# Altium project AEX1_PiOBD.PrjPcb (part 3 of 3)

## Sheet OBD_STN2120.SchDoc
size A3; DocumentNumber: 3; SheetNumber: 2; SheetTotal: 7; PostalCode_City: PostalCode_City; Country: Country; Company: Robert BOSCH GmbH; TelefonNumber: TelefonNumber; Street: Street; Department: Department
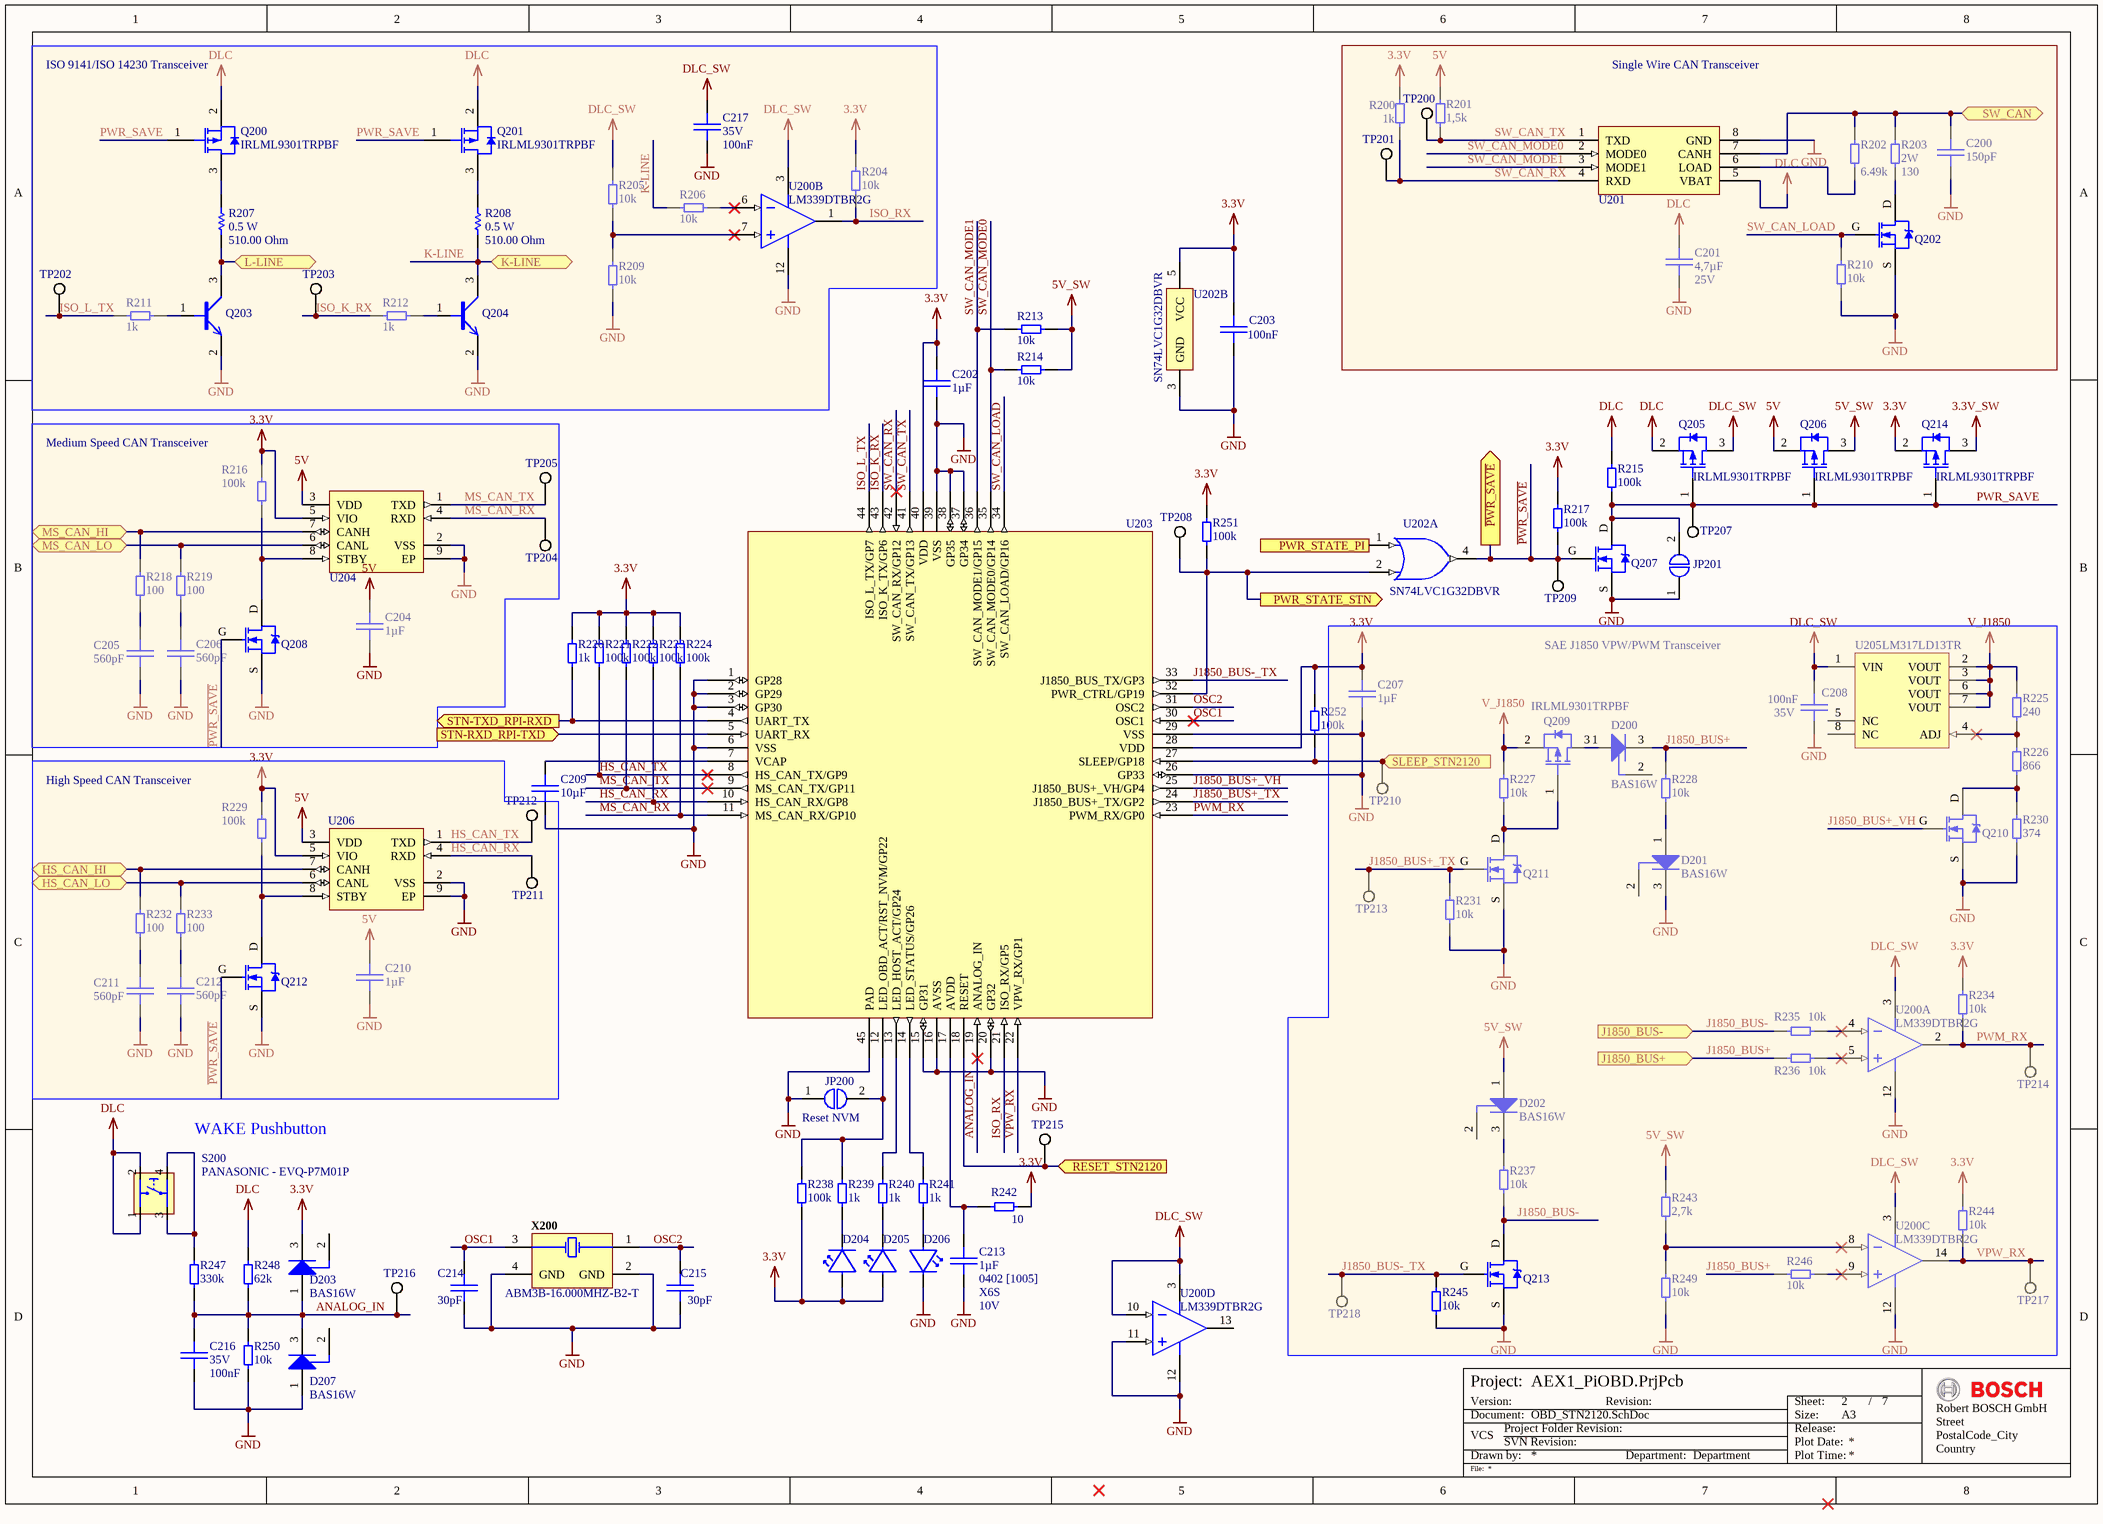
[diagram p6: OBD_STN2120.SchDoc]

### Parts
C200  Capacitance: 150pF  [CAP 0402 [1005 Metric] X050 N]  (hidden comment: CAP 0402 150p -5% +5% 25V C0G)
C201  Capacitance: 4,7µF  Voltage Rating: 25V  [CAP 0603 [1608 Metric] X080 N]  (hidden comment: CAP 0603 4u7 -20% +20% 25V X5R)
C202  Capacitance: 1µF  [CAP 0402 [1005 Metric] X050 N]  (hidden comment: CAP 0402 1u -10% +10% 10V X6S)
C203  Capacitance: 100nF  [CAP 0402 [1005 Metric] X050 N]  (hidden comment: CAP 0402 100n -10% +10% 35V X5R)
C204  Capacitance: 1µF  [CAP 0402 [1005 Metric] X050 N]  (hidden comment: CAP 0402 1u -10% +10% 10V X6S)
C205  Capacitance: 560pF  [CAP 0402 [1005 Metric] X050 N]  (hidden comment: CAP 0402 560p -5% +5% 25V C0G)
C206  Capacitance: 560pF  [CAP 0402 [1005 Metric] X050 N]  (hidden comment: CAP 0402 560p -5% +5% 25V C0G)
C207  Capacitance: 1µF  [CAP 0402 [1005 Metric] X050 N]  (hidden comment: CAP 0402 1u -10% +10% 10V X6S)
C208  Voltage Rating: 35V  Capacitance: 100nF  [CAP 0402 [1005 Metric] X050 N]  (hidden comment: CAP 0402 100n -10% +10% 35V X5R)
C209  Capacitance: 10µF  [CAP 0603 [1608 Metric] X080 N]  (hidden comment: CAP 0603 10µF -10% + 10% 16V X5R)
C210  Capacitance: 1µF  [CAP 0402 [1005 Metric] X050 N]  (hidden comment: CAP 0402 1u -10% +10% 10V X6S)
C211  Capacitance: 560pF  [CAP 0402 [1005 Metric] X050 N]  (hidden comment: CAP 0402 560p -5% +5% 25V C0G)
C212  Capacitance: 560pF  [CAP 0402 [1005 Metric] X050 N]  (hidden comment: CAP 0402 560p -5% +5% 25V C0G)
C213  Capacitance: 1µF  Case: 0402 [1005]  Dielectric Type: X6S  Voltage Rating: 10V  [CAP 0402 [1005 Metric] X050 N]  (hidden comment: CAP 0402 1u -10% +10% 10V X6S)
C214  Capacitance: 30pF  [CAP 0402 [1005 Metric] X050 N]  (hidden comment: CAP 0402 30p -2% +2% 25V C0G)
C215  Capacitance: 30pF  [CAP 0402 [1005 Metric] X050 N]  (hidden comment: CAP 0402 30p -2% +2% 25V C0G)
C216  Voltage Rating: 35V  Capacitance: 100nF  [CAP 0402 [1005 Metric] X050 N]  (hidden comment: CAP 0402 100n -10% +10% 35V X5R)
C217  Voltage Rating: 35V  Capacitance: 100nF  [CAP 0402 [1005 Metric] X050 N]  (hidden comment: CAP 0402 100n -10% +10% 35V X5R)
D200  BAS16W  [INF-SOT323_M]
D201  BAS16W  [INF-SOT323_M]
D202  BAS16W  [INF-SOT323_M]
D203  BAS16W  [INF-SOT323_M]
D204  ROHM - SML-P11MT(R)  [ROHM - SML-P11x Series]  (value not drawn)
D205  ROHM - SML-P11MT(R)  [ROHM - SML-P11x Series]  (value not drawn)
D206  ROHM - SML-P11MT(R)  [ROHM - SML-P11x Series]  (value not drawn)
D207  BAS16W  [INF-SOT323_M]
JP200  Solder Jumper 0402 unbestückt  [Solder Jumper 0402 unbestückt]  (value not drawn)
JP201  Solder Jumper 0402 unbestückt  [Solder Jumper 0402 unbestückt]  (value not drawn)
Q200  IRLML9301TRPBF  [INF-SOT-23-3_V]
Q201  IRLML9301TRPBF  [INF-SOT-23-3_V]
Q202  ON SEMICONDUCTOR - BSS138  [SOT23127P600-8N]  (value not drawn)
Q203  DIODES INCORPORATED - MMBT2222A-7-F  [SOT23]  (value not drawn)
Q204  DIODES INCORPORATED - MMBT2222A-7-F  [SOT23]  (value not drawn)
Q205  IRLML9301TRPBF  [INF-SOT-23-3_V]
Q206  IRLML9301TRPBF  [INF-SOT-23-3_V]
Q207  ON SEMICONDUCTOR - BSS138  [SOT23127P600-8N]  (value not drawn)
Q208  ON SEMICONDUCTOR - BSS138  [SOT23127P600-8N]  (value not drawn)
Q209  IRLML9301TRPBF  [INF-SOT-23-3_V]
Q210  ON SEMICONDUCTOR - BSS138  [SOT23127P600-8N]  (value not drawn)
Q211  ON SEMICONDUCTOR - BSS138  [SOT23127P600-8N]  (value not drawn)
Q212  ON SEMICONDUCTOR - BSS138  [SOT23127P600-8N]  (value not drawn)
Q213  ON SEMICONDUCTOR - BSS138  [SOT23127P600-8N]  (value not drawn)
Q214  IRLML9301TRPBF  [INF-SOT-23-3_V]
R200  Resistance: 1k  [RES 0402 [1005 Metric]_N]  (hidden comment: RES 0402 1K 1% 62.5mW)
R201  Resistance: 1,5k  [RES 0402 [1005 Metric]_N]  (hidden comment: RES 0402 1K5 1% 62.5mW)
R202  Resistance: 6.49k  [RES 0805 [2012 Metric] X070 N]  (hidden comment: RES 0805 6K49 1% 125mW)
R203  Power Rating: 2W  Resistance: 130  [RES 2512 [6432 Metric] M]  (hidden comment: RES 2512 130R 1% 2W)
R204  Resistance: 10k  [RES 0402 [1005 Metric]_N]  (hidden comment: RES 0402 10K 1% 62.5mW)
R205  Resistance: 10k  [RES 0402 [1005 Metric]_N]  (hidden comment: RES 0402 10K 1% 62.5mW)
R206  Resistance: 10k  [RES 0402 [1005 Metric]_N]  (hidden comment: RES 0402 10K 1% 62.5mW)
R207  value 510.00 Ohm  Power: 0.5 W  [RESC1210(3225)_L]  (hidden comment: 510R 5% 1210(3225))
R208  value 510.00 Ohm  Power: 0.5 W  [RESC1210(3225)_L]  (hidden comment: 510R 5% 1210(3225))
R209  Resistance: 10k  [RES 0402 [1005 Metric]_N]  (hidden comment: RES 0402 10K 1% 62.5mW)
R210  Resistance: 10k  [RES 0402 [1005 Metric]_N]  (hidden comment: RES 0402 10K 1% 62.5mW)
R211  Resistance: 1k  [RES 0402 [1005 Metric]_N]  (hidden comment: RES 0402 1K 1% 62.5mW)
R212  Resistance: 1k  [RES 0402 [1005 Metric]_N]  (hidden comment: RES 0402 1K 1% 62.5mW)
R213  Resistance: 10k  [RES 0402 [1005 Metric]_N]  (hidden comment: RES 0402 10K 1% 62.5mW)
R214  Resistance: 10k  [RES 0402 [1005 Metric]_N]  (hidden comment: RES 0402 10K 1% 62.5mW)
R215  Resistance: 100k  [RES 0402 [1005 Metric]_N]  (hidden comment: RES 0402 100K 1% 62.5mW)
R216  Resistance: 100k  [RES 0402 [1005 Metric]_N]  (hidden comment: RES 0402 100K 1% 62.5mW)
R217  Resistance: 100k  [RES 0402 [1005 Metric]_N]  (hidden comment: RES 0402 100K 1% 62.5mW)
R218  Resistance: 100  [RES 0402 [1005 Metric]_N]  (hidden comment: RES 0402 100R 1% 62.5mW)
R219  Resistance: 100  [RES 0402 [1005 Metric]_N]  (hidden comment: RES 0402 100R 1% 62.5mW)
R220  Resistance: 1k  [RES 0402 [1005 Metric]_N]  (hidden comment: RES 0402 1K 1% 62.5mW)
R221  Resistance: 100k  [RES 0402 [1005 Metric]_N]  (hidden comment: RES 0402 100K 1% 62.5mW)
R222  Resistance: 100k  [RES 0402 [1005 Metric]_N]  (hidden comment: RES 0402 100K 1% 62.5mW)
R223  Resistance: 100k  [RES 0402 [1005 Metric]_N]  (hidden comment: RES 0402 100K 1% 62.5mW)
R224  Resistance: 100k  [RES 0402 [1005 Metric]_N]  (hidden comment: RES 0402 100K 1% 62.5mW)
R225  Resistance: 240  [RES 0402 [1005 Metric]_N]  (hidden comment: RES 0402 240R 1% 62.5mW)
R226  Resistance: 866  [RES 0402 [1005 Metric]_N]  (hidden comment: RES 0402 866R 1% 62.5mW)
R227  Resistance: 10k  [RES 0402 [1005 Metric]_N]  (hidden comment: RES 0402 10K 1% 62.5mW)
R228  Resistance: 10k  [RES 0402 [1005 Metric]_N]  (hidden comment: RES 0402 10K 1% 62.5mW)
R229  Resistance: 100k  [RES 0402 [1005 Metric]_N]  (hidden comment: RES 0402 100K 1% 62.5mW)
R230  Resistance: 374  [RES 0402 [1005 Metric]_N]  (hidden comment: RES 0402 374R 1% 62.5mW)
R231  Resistance: 10k  [RES 0402 [1005 Metric]_N]  (hidden comment: RES 0402 10K 1% 62.5mW)
R232  Resistance: 100  [RES 0402 [1005 Metric]_N]  (hidden comment: RES 0402 100R 1% 62.5mW)
R233  Resistance: 100  [RES 0402 [1005 Metric]_N]  (hidden comment: RES 0402 100R 1% 62.5mW)
R234  Resistance: 10k  [RES 0402 [1005 Metric]_N]  (hidden comment: RES 0402 10K 1% 62.5mW)
R235  Resistance: 10k  [RES 0402 [1005 Metric]_N]  (hidden comment: RES 0402 10K 1% 62.5mW)
R236  Resistance: 10k  [RES 0402 [1005 Metric]_N]  (hidden comment: RES 0402 10K 1% 62.5mW)
R237  Resistance: 10k  [RES 0402 [1005 Metric]_N]  (hidden comment: RES 0402 10K 1% 62.5mW)
R238  Resistance: 100k  [RES 0402 [1005 Metric]_N]  (hidden comment: RES 0402 100K 1% 62.5mW)
R239  Resistance: 1k  [RES 0402 [1005 Metric]_N]  (hidden comment: RES 0402 1K 1% 62.5mW)
R240  Resistance: 1k  [RES 0402 [1005 Metric]_N]  (hidden comment: RES 0402 1K 1% 62.5mW)
R241  Resistance: 1k  [RES 0402 [1005 Metric]_N]  (hidden comment: RES 0402 1K 1% 62.5mW)
R242  Resistance: 10  [RES 0402 [1005 Metric]_N]  (hidden comment: RES 0402 10R 1% 62.5mW)
R243  Resistance: 2,7k  [RES 0402 [1005 Metric]_N]  (hidden comment: RES 0402 2K7 1% 62.5mW)
R244  Resistance: 10k  [RES 0402 [1005 Metric]_N]  (hidden comment: RES 0402 10K 1% 62.5mW)
R245  Resistance: 10k  [RES 0402 [1005 Metric]_N]  (hidden comment: RES 0402 10K 1% 62.5mW)
R246  Resistance: 10k  [RES 0402 [1005 Metric]_N]  (hidden comment: RES 0402 10K 1% 62.5mW)
R247  Resistance: 330k  [RES 0402 [1005 Metric] L]  (hidden comment: RES 0402 330K 1% 62.5mW)
R248  Resistance: 62k  [RES 0402 [1005 Metric]_N]  (hidden comment: RES 0402 62K 1% 62.5mW)
R249  Resistance: 10k  [RES 0402 [1005 Metric]_N]  (hidden comment: RES 0402 10K 1% 62.5mW)
R250  Resistance: 10k  [RES 0402 [1005 Metric]_N]  (hidden comment: RES 0402 10K 1% 62.5mW)
R251  Resistance: 100k  [RES 0402 [1005 Metric]_N]  (hidden comment: RES 0402 100K 1% 62.5mW)
R252  Resistance: 100k  [RES 0402 [1005 Metric]_N]  (hidden comment: RES 0402 100K 1% 62.5mW)
S200  PANASONIC - EVQ-P7M01P  [EVQP7M]
TP200  Testpad, 1.0mm x 1.0mm, round  [Testpad, 1.0mm x 1.0mm, round]  (value not drawn)  (no BOM)
TP201  Testpad, 1.0mm x 1.0mm, round  [Testpad, 1.0mm x 1.0mm, round]  (value not drawn)  (no BOM)
TP202  Testpad, 1.0mm x 1.0mm, round  [Testpad, 1.0mm x 1.0mm, round]  (value not drawn)  (no BOM)
TP203  Testpad, 1.0mm x 1.0mm, round  [Testpad, 1.0mm x 1.0mm, round]  (value not drawn)  (no BOM)
TP204  Testpad, 1.0mm x 1.0mm, round  [Testpad, 1.0mm x 1.0mm, round]  (value not drawn)  (no BOM)
TP205  Testpad, 1.0mm x 1.0mm, round  [Testpad, 1.0mm x 1.0mm, round]  (value not drawn)  (no BOM)
TP207  Testpad, 1.0mm x 1.0mm, round  [Testpad, 1.0mm x 1.0mm, round]  (value not drawn)  (no BOM)
TP208  Testpad, 1.0mm x 1.0mm, round  [Testpad, 1.0mm x 1.0mm, round]  (value not drawn)  (no BOM)
TP209  Testpad, 1.0mm x 1.0mm, round  [Testpad, 1.0mm x 1.0mm, round]  (value not drawn)  (no BOM)
TP210  Testpad, 1.0mm x 1.0mm, round  [Testpad, 1.0mm x 1.0mm, round]  (value not drawn)  (no BOM)
TP211  Testpad, 1.0mm x 1.0mm, round  [Testpad, 1.0mm x 1.0mm, round]  (value not drawn)  (no BOM)
TP212  Testpad, 1.0mm x 1.0mm, round  [Testpad, 1.0mm x 1.0mm, round]  (value not drawn)  (no BOM)
TP213  Testpad, 1.0mm x 1.0mm, round  [Testpad, 1.0mm x 1.0mm, round]  (value not drawn)  (no BOM)
TP214  Testpad, 1.0mm x 1.0mm, round  [Testpad, 1.0mm x 1.0mm, round]  (value not drawn)  (no BOM)
TP215  Testpad, 1.0mm x 1.0mm, round  [Testpad, 1.0mm x 1.0mm, round]  (value not drawn)  (no BOM)
TP216  Testpad, 1.0mm x 1.0mm, round  [Testpad, 1.0mm x 1.0mm, round]  (value not drawn)  (no BOM)
TP217  Testpad, 1.0mm x 1.0mm, round  [Testpad, 1.0mm x 1.0mm, round]  (value not drawn)  (no BOM)
TP218  Testpad, 1.0mm x 1.0mm, round  [Testpad, 1.0mm x 1.0mm, round]  (value not drawn)  (no BOM)
U200  LM339DTBR2G  [ONSC-TSSOP-14-948G-01_V]  (parts A,B,C,D of 4)
U201  MELEXIS - TH8056KDC-AAA-008-RE  [SOIC127P600X172-8N]  (value not drawn)
U202  SN74LVC1G32DBVR  [DBV0005A_L]  (parts A,B of 2)
U203  OBD SOLUTIONS - STN2120  [QFN65P800X800X100_HS-45N]  (value not drawn)
U204  MICROCHIP - MCP2562-E/MF  [SON65P300X100_HS-9N]  (value not drawn)
U205  LM317LD13TR  [SO8_L]
U206  MICROCHIP - MCP2562-E/MF  [SON65P300X100_HS-9N]  (value not drawn)
X200  ABM3B-16.000MHZ-B2-T  [ABRA-ABM3B-4_V]

### Blocks framed on the sheet
ISO 9141/ISO 14230 Transceiver: C217 Q200 Q201 Q203 Q204 R204-R209 R211 R212 TP202 TP203 U200
Single Wire CAN Transceiver: C200 C201 Q202 R200-R203 R210 TP200 TP201 U201
Medium Speed CAN Transceiver: C204-C206 Q208 R216 R218 R219 TP204 TP205 U204
SAE J1850 VPW/PWM Transceiver: C207 C208 D200-D202 Q209-Q211 Q213 R225-R228 R230 R231 R234-R237 R243-R246 R249 TP210 TP213 TP214 TP217 TP218 U200 U205
High Speed CAN Transceiver: C210-C212 Q212 R229 R232 R233 TP211 TP212 U206

### Ports
HS_CAN_HI (bidir), HS_CAN_LO (bidir), J1850_BUS+ (in), J1850_BUS- (in), K-LINE (bidir), L-LINE (bidir), MS_CAN_HI (bidir), MS_CAN_LO (bidir), PWR_STATE_PI (in), PWR_STATE_STN (out), RESET_STN2120 (in), SLEEP_STN2120 (in), STN-RXD_RPI-TXD (in), STN-TXD_RPI-RXD (out), SW_CAN (bidir), ~{PWR_SAVE} (out)

### Nets
3.3V: C202.2 C203.2 C207.2 D203.3(K) D204.A D205.A Q214.2(SOURCE) R200.1 R204.2 R216.2 R217.2 R220.2 R221.2 R222.2 R223.2 R224.2 R229.2 R234.2 R238.2 R242.2 R244.2 R251.2 R252.2 U202.5(VCC) U203.28(VDD) U203.40(VDD) U204.5(VIO) U206.5(VIO)
3.3V_SW: Q214.3(DRAIN)
5V: C204.1 C210.1 Q206.2(SOURCE) R201.2 U204.3(VDD) U206.3(VDD)
5V_SW: D202.1(A) Q206.3(DRAIN) R213.2 R214.2 R243.2
DLC: C201.2 Q200.2(SOURCE) Q201.2(SOURCE) Q205.2(SOURCE) R215.2 R248.2 S200.1 S200.2 U201.5(VBAT)
DLC_SW: C208.2 C217.2 Q205.3(DRAIN) R205.1 U200.3(VCC) U200.10(IN4-) U205.1(VIN)
GND: C200.1 C201.1 C202.1 C203.1 C204.2 C205.1 C206.1 C207.1 C208.1 C209.1 C210.2 C211.1 C212.1 C213.2 C214.2 C215.2 C216.1 C217.1 D201.3(K) D206.C D207.1(A) JP200.1 JP201.1 Q202.S Q203.2(E) Q204.2(E) Q207.S Q208.S Q210.S Q211.S Q212.S Q213.S R209.2 R210.1 R230.1 R231.1 R245.1 R249.1 R250.1 U200.11(IN4+) U200.12(GND) U201.8(GND) U202.3(GND) U203.1(GP28) U203.2(GP29) U203.3(GP30) U203.6(VSS) U203.15(GP31) U203.16(AVSS) U203.20(GP32) U203.26(GP33) U203.29(VSS) U203.37(GP34) U203.38(GP35) U203.39(VSS) U203.45(PAD) U204.2(VSS) U204.9(EP) U206.2(VSS) U206.9(EP) X200.2(GND) X200.4(GND)
V_J1850: Q209.2(SOURCE) R225.2 R227.2 U205.2(VOUT) U205.3(VOUT) U205.6(VOUT) U205.7(VOUT)
~{PWR_SAVE}: Q207.G Q208.G Q212.G R217.1 TP209.1 U202.4(Y) ; port ~{PWR_SAVE}
ANALOG_IN: C216.2 D203.1(A) D207.3(K) R247.1 R248.1 R250.2 TP216.1 U203.19(ANALOG_IN)
HS_CAN_RX: R223.1 TP211.1 U203.10(HS_CAN_RX/GP8) U206.4(RXD)
HS_CAN_TX: R221.1 TP212.1 U203.8(HS_CAN_TX/GP9) U206.1(TXD)
ISO_K_RX: R212.2 TP203.1 U203.43(ISO_K_TX/GP6)
ISO_L_TX: R211.1 TP202.1 U203.44(ISO_L_TX/GP7)
ISO_RX: R204.1 U200.1(OUT2) U203.21(ISO_RX/GP5)
J1850_BUS+: D200.3(K) R228.2 R236.2 R246.2 ; port J1850_BUS+
J1850_BUS+_TX: Q211.G R231.2 TP213.1 U203.24(J1850_BUS+_TX/GP2)
J1850_BUS+_VH: Q210.G U203.25(J1850_BUS+_VH/GP4)
J1850_BUS-: Q213.D R235.2 R237.1 ; port J1850_BUS-
J1850_BUS-_TX: Q213.G R245.2 TP218.1 U203.33(J1850_BUS_TX/GP3)
K-LINE: Q204.3(C) R206.2 R208.1 ; port K-LINE
MS_CAN_RX: R224.1 TP204.1 U203.11(MS_CAN_RX/GP10) U204.4(RXD)
MS_CAN_TX: R222.1 TP205.1 U203.9(MS_CAN_TX/GP11) U204.1(TXD)
OSC1: C214.1 U203.30(OSC1) X200.3(X2)
OSC2: C215.1 U203.31(OSC2) X200.1(X1)
PWM_RX: R234.1 TP214.1 U200.2(OUT1) U203.23(PWM_RX/GP0)
PWR_SAVE: JP201.2 Q200.1(GATE) Q201.1(GATE) Q205.1(GATE) Q206.1(GATE) Q207.D Q214.1(GATE) R215.1 TP207.1
SW_CAN_LOAD: Q202.G R210.2 U203.34(SW_CAN_LOAD/GP16)
SW_CAN_MODE0: R214.1 U201.2(MODE0) U203.35(SW_CAN_MODE0/GP14)
SW_CAN_MODE1: R213.1 U201.3(MODE1) U203.36(SW_CAN_MODE1/GP15)
SW_CAN_RX: R200.2 TP201.1 U201.4(RXD) U203.42(SW_CAN_RX/GP12)
SW_CAN_TX: R201.1 TP200.1 U201.1(TXD) U203.41(SW_CAN_TX/GP13)
VPW_RX: R244.1 TP217.1 U200.14(OUT3) U203.22(VPW_RX/GP1)
NetC200_2: C200.2 R202.2 R203.2 U201.7(CANH) ; port SW_CAN
NetC205_2: C205.2 R218.1
NetC206_2: C206.2 R219.1
NetC209_2: C209.2 U203.7(VCAP)
NetC211_2: C211.2 R232.1
NetC212_2: C212.2 R233.1
NetC213_1: C213.1 R242.1 U203.17(AVDD)
NetD101_1: Q203.3(C) R207.1 ; port L-LINE
NetD103_1: R233.2 U206.6(CANL) ; port HS_CAN_LO
NetD103_2: R232.2 U206.7(CANH) ; port HS_CAN_HI
NetD104_1: R219.2 U204.6(CANL) ; port MS_CAN_LO
NetD104_2: R218.2 U204.7(CANH) ; port MS_CAN_HI
NetD200_1: D200.1(A) Q209.3(DRAIN)
NetD201_1: D201.1(A) R228.1
NetD202_3: D202.3(K) R237.2
NetD204_C: D204.C R239.2
NetD205_C: D205.C R240.2
NetD206_A: D206.A R241.2
NetJ300_2: U203.5(UART_RX) ; port STN-RXD_RPI-TXD
NetJ300_4: R220.1 U203.4(UART_TX) ; port STN-TXD_RPI-RXD
NetJP200_2: JP200.2 R238.1 R239.1 U203.12(LED_OBD_ACT/RST_NVM/GP22)
NetJP301_1: R251.1 TP208.1 U202.2(B) U203.32(PWR_CTRL/GP19) ; port PWR_STATE_STN
NetJP303_1: R252.1 TP210.1 U203.27(SLEEP/GP18) ; port SLEEP_STN2120
NetQ200_3: Q200.3(DRAIN) R207.2
NetQ201_3: Q201.3(DRAIN) R208.2
NetQ202_D: Q202.D R203.1
NetQ203_1: Q203.1(B) R211.2
NetQ204_1: Q204.1(B) R212.1
NetQ208_D: Q208.D R216.1 U204.8(STBY)
NetQ209_1: Q209.1(GATE) Q211.D R227.1
NetQ210_D: Q210.D R226.1 R230.2
NetQ212_D: Q212.D R229.1 U206.8(STBY)
NetQ300_G: U202.1(A) ; port PWR_STATE_PI
NetR202_1: R202.1 U201.6(LOAD)
NetR205_2: R205.2 R209.1 U200.7(IN2+)
NetR206_1: R206.1 U200.6(IN2-)
NetR225_1: R225.1 R226.2 U205.4(ADJ)
NetR235_1: R235.1 U200.4(IN1-)
NetR236_1: R236.1 U200.5(IN1+)
NetR240_1: R240.1 U203.13(LED_HOST_ACT/GP24)
NetR241_1: R241.1 U203.14(LED_STATUS/GP26)
NetR243_1: R243.1 R249.2 U200.8(IN3-)
NetR246_1: R246.1 U200.9(IN3+)
NetR247_2: R247.2 S200.3 S200.4
NetR301_1: TP215.1 U203.18(RESET) ; port RESET_STN2120

Not connected (* = marked no-connect by the designer): D200 2(NC); D201 2(NC); D202 2(NC); D203 2(NC); D207 2(NC); U200 13(OUT4); U205 5(NC) 8(NC)

### Notes on the sheet
- (near JP200) Reset NVM
- (near S200) WAKE Pushbutton
- Project:
- Document:
- Drawn by:
- VCS
- Version:
- Project Folder Revision:
- SVN Revision:
- Revision:
- Department:
- Plot Date:
- Size:
- Sheet:
- Plot Time:
- Release:
- A3
- /
- File:

### Library data of the parts
C200 = CMP-03768-2: SMD/SMT 0402 25V -5% +5% C0G - Multilayer Ceramic Capacitors MLCC; Manufacturer: MURATA; Manufacturer Part Number: GRM1555C1E151JA01#; Assembly: yes; Capacitance Tolerance pos: 5%; Value: 150pF; Capacitance Tolerance neg: -5%; Case: 0402 [1005]; ComponentLink1Description: Datasheet; ComponentLink1URL: http://psearch.en.murata.com/capacitor/lineup/grm/; Dielectric Type: C0G; IPC Footprint Naming: CAPC1005X050; Mounting Type: SMT; Operating Temperature max: 125°C; Operating Temperature min: -55°C; Voltage Rating: 25V
C201 = CMP-05102-1: SMD/SMT 0603 25V -20% +20% X5R - Multilayer Ceramic Capacitors MLCC; Manufacturer: TDK; Manufacturer Part Number: C1608X5R1E475M080AC; Assembly: yes; Capacitance Tolerance pos: 20%; Value: 4,7µF; ItemHRID: CMP-03365; RevisionId: 2; AccessRights: 15; Folder: 10 Library\Component Library\Passive Components\Capacitors\Ceramic Capacitors\; ContentType: Component; Capacitance Tolerance neg: -20%; Case: 0603 [1608]; ComponentLink1Description: Datasheet; ComponentLink1URL: http://www.farnell.com/datasheets/2291921.pdf; Dielectric Type: X5R; IPC Footprint Naming: CAPC1608X080; Mounting Type: SMT; Operating Temperature max: 85°C; Operating Temperature min: -55°C; ReleaseDate: 20/01/2017 12:59:13 PM; ComponentType: Ceramic Capacitor; FolderGUID: 1B932E09-F2A4-48AF-86E9-372599342254; LifeCycle: In Design; AncestorItemRevisionGUID: E51D455D-F8A1-44A6-8671-03D7555E002A; LifeCycleStateGUID: E3052186-9469-4B71-ADAB-0D319103D948; ContentTypeGUID: CB3C11C4-E317-11DF-B822-12313F0024A2; ItemGUID: 2606C917-888A-4062-919A-A6B1386C23AD
C202 C204 C207 C210 C213 = CMP-05092-2: SMD/SMT 0402 10V -10% +10% X6S - Mulitlayer Ceramic Capacitors MLCC; Manufacturer: TDK; Manufacturer Part Number: C1005X6S1A105K050BC; Assembly: yes; Capacitance Tolerance pos: 10%; Value: 1µF; Capacitance Tolerance neg: -10%; ComponentLink1Description: Datasheet; ComponentLink1URL: http://www.farnell.com/datasheets/2291921.pdf; Mounting Type: SMT; Operating Temperature max: 105°C; Operating Temperature min: -55°C
  C202 C204 C207 C210: Case: 0402 [1005]; Dielectric Type: X6S; Voltage Rating: 10V
C203 C208 C216 C217 = CMP-06091-1: SMD/SMT 0402 35V -10% +10% X5R - Multilayer Ceramic Capacitors MLCC; Manufacturer: TDK; Manufacturer Part Number: C1005X5R1V104K050BB; Assembly: yes; Value: 100nF; Capacitance Tolerance pos: 10%; Case: 0402 [1005]; ComponentLink1Description: Datasheet; ComponentLink1URL: https://de.farnell.com/tdk/c1005x5r1v104k050bb/kondensator-0-1-f-35v-10-x5r-0402/dp/2528760?st=100n%200402%2035v; Dielectric Type: X5R; IPC Footprint Naming: CAPC1005X050; Mounting Type: SMT; Operating Temperature max: 85°C; Operating Temperature min: -55°C; Capacitance Tolerance neg: -10%
  C203: Voltage Rating: 35V
C205 C206 C211 C212 = CMP-03930-2: SMD/SMT 0402 25V -5% +5% C0G - Multilayer Ceramic Capacitors MLCC; Manufacturer: MURATA; Manufacturer Part Number: GRM1555C1E561JA01#; Assembly: yes; Capacitance Tolerance pos: 5%; Value: 560pF; Capacitance Tolerance neg: -5%; Case: 0402 [1005]; ComponentLink1Description: Datasheet; Dielectric Type: C0G; ComponentLink1URL: http://psearch.en.murata.com/capacitor/lineup/grm/; IPC Footprint Naming: CAPC1005X050; Mounting Type: SMT; Operating Temperature max: 125°C; Operating Temperature min: -55°C; Voltage Rating: 25V
C209 = CMP-05416-1: Cap Ceramic 10uF 16V X5R 10% Pad SMD 0603 85 T/R; Manufacturer: MURATA; Manufacturer Part Number: GRM188R61C106KAALD; Assembly: yes; Capacitance Tolerance pos: +10%; Capacitance Tolerance neg: -10%; Case: 0603 [1608]; ComponentLink1Description: Datasheet; ComponentLink1URL: https://search.murata.co.jp/Ceramy/image/img/A01X/G101/ENG/GRM188R61C106KAAL-01.pdf; Dielectric Type: X5R; Mounting Type: SMT; Operating Temperature max: 85°C; Operating Temperature min: -55°C; Value: 10µF; Voltage Rating: 16V
C214 C215 = CMP-03847-2: SMD/SMT 0402 25V -2% +2% C0G - Multilayer Ceramic Capacitors MLCC; Manufacturer: MURATA; Manufacturer Part Number: GRM1555C1E300GA01#; Assembly: yes; Capacitance Tolerance pos: 2%; Value: 30pF; Capacitance Tolerance neg: -2%; Case: 0402 [1005]; ComponentLink1URL: http://psearch.en.murata.com/capacitor/lineup/grm/; Dielectric Type: C0G; IPC Footprint Naming: CAPC1005X050; ComponentLink1Description: Datasheet; Mounting Type: SMT; Operating Temperature max: 125°C; Operating Temperature min: -55°C; Voltage Rating: 25V
D200-D203 D207 = CMP-1176-00024-1: Silicon Switching Diode, SOT323, Reel, Green; Manufacturer: Infineon; IR (max): 100Â nA; Configuration: Single; VBR (min): 85Â V; VR (max): 80Â V; trr (max): 4Â ns; Green: TRUE; VF (max): 1.25Â V; IF (max): 250Â mA; Mounting Technology: Surface Mount; PackageReference: SOT323; ComponentLink2URL: http://www.infineon.com/dgdl/bas16series.pdf?folderId=db3a30431400ef6801141b5844e103ea&fileId=db3a30431400ef6801141b93811b03ff; Halogen-free: TRUE; ComponentLink2Description: Datasheet; PartNumber: BAS16W; ComponentLink1Description: Manufacturer URL; ComponentLink3URL: http://www.infineon.com/dgdl/SOT323-Package_Overview.pdf?folderId=db3a30431936bc4b0119533e1dcb3c92&fileId=db3a30431936bc4b011953495f283cb1; ComponentLink1URL: http://www.infineon.com/; PackageDescription: 3-Pin Small Outline Transistor Package, 1.25 x 2 mm Body, 0.65 mm Pitch; ComponentLink3Description: Package Specification
D204-D206 = CMP-06096-1: Standard LEDs - SMD Yellowish Green 569nm 2.1mcd 50mW Pd 1.9V Vf; Assembly: yes; Forward Current LED1: 20mA; Forward Voltage LED1: 1,9V; Reverse Voltage LED1: 5V; Case: 0402; Colour LED1: yellowish green; ComponentLink1Description: Datahseet; ComponentLink1URL: https://d1d2qsbl8m0m72.cloudfront.net/en/products/databook/datasheet/opto/led/chip_mono/sml-p11-e.pdf; Luminous Intensity LED1: 2.1mcd; Manufacturer: ROHM; Manufacturer Part Number: SML-P11MT(R); Mounting Type: SMT; Operating Temperature max: 85°C; Operating Temperature min: -40°C; Wavelength LED1: 569nm
JP200 JP201 = CMP-04662-5: Assembly: no; Case: -; ComponentLink1Description: Datasheet; Manufacturer: -; Manufacturer Part Number: -; Mounting Type: -; Operating Temperature max: 0°C; Operating Temperature min: 0°C
Q200 Q201 Q205 Q206 Q209 Q214 = CMP-2000-06487-1: HEXFET(R) Power MOSFET, 3.6 A, 30 V, -55 to 150 degC, 3-Pin SOT-23, RoHS, Tape and Reel; Manufacturer: InfineonTechnologies; Drain to Source Voltage (Vdss): 30V; Gate Charge (Qg) @ Vgs: 4.8nC@4.5V; Rds On (Max) @ Id, Vgs: 64mOhm@3.6A,10V; FET Type: MOSFETP-Channel,MetalOxide; Current - Continuous Drain (Id) @ 25°C: 3.6A(Ta); Power - Max: 1.3W; Vgs(th) (Max) @ Id: 2.4V@10µA; FET Feature: Standard; Input Capacitance (Ciss) @ Vds: 388pF@25V; Operating Temperature: -55°C~150°C(TJ); Series: HEXFET®; Family: Transistors-FETs,MOSFETs-Single; Manufacturer URL: http://www.infineon.com/; Package Reference: SOT-23-3; Datasheet Version: 02/2012; Category: DiscreteSemiconductorProducts; Part Status: Active; Mounting Technology: SurfaceMount; Datasheet URL: http://www.infineon.com/dgdl/irlml9301pbf.pdf?fileId=5546d462533600a401535668e5e42640; Supplier Device Package: Micro3™/SOT-23; Mounting Type: SurfaceMount; Packaging: Tape&Reel(TR); Package / Case: TO-236-3,SC-59,SOT-23-3; Package Description: 3-Pin Small Outline Transistor, Body 2.92 x 1.3 mm, Pitch 0.95 mm
Q202 Q207 Q208 Q210-Q213 = CMP-00444-5: MOSFET N-CH 50V 220MA SOT-23; Threshold Voltage: 1.3V; Transistor Polarity: N-Channel; Assembly: yes; Drain Source On Resistance: 3.5; Gate Source Voltage: 20V; Operating Temperature min: -55°C; Case: SOT23-3; ComponentLink1Description: Datasheet; ComponentLink1URL: https://www.onsemi.com/pub/Collateral/BSS138-D.PDF; Drain Current DC: 220mA; Drain Source Voltage: 50V; Manufacturer: ON SEMICONDUCTOR; Manufacturer Part Number: BSS138; Mounting Type: SMT; Operating Temperature max: 150°C
Q203 Q204 = CMP-06652-2: NPN small signal transistor, 40V, 600mA, SOT23; Assembly: yes; Collector Basis Voltage: 75V; DC Current Gain max: 300; DC Current Gain min: 100; Emitter Basis Voltage: 6V; Power Dissipation: 300mW; Case: SOT23; Collector Emitter Breakdown Voltage: 40V; Collector Emitter Voltage: 40V; ComponentLink1Description: Manufacturer Link; ComponentLink1URL: http://www.farnell.com/datasheets/2238355.pdf; Manufacturer: DIODES INCORPORATED; Manufacturer Part Number: MMBT2222A-7-F; Mounting Type: SMT; Operating Temperature max: 150°C; Operating Temperature min: -55°C; Transistor Polarity: NPN
R200 R211 R212 R220 R239-R241 = CMP-00843-3: RC0402 series chip resistor with lead-free terminations made by thick film process; Manufacturer Part Number: RC0402FR-071KL; Manufacturer: YAGEO; Power Rating: 62,5mW; Temperature Coefficient: ±100ppm/K; Voltage Rating: 50V; Assembly: yes; Current Rating: 1A; Mounting Type: SMT; Operating Temperature max: 155°C; Operating Temperature min: -55°C; Resistance Tolerance: 1%; Resistor Element Type: Thick Film; Value: 1k; Case: 0402 [1005]; ComponentLink1Description: Datasheet; ComponentLink1URL: http://www.yageo.com/documents/recent/PYu-RC0402_51_RoHS_L_6.pdf; IPC Footprint Naming: RESC1005X04
R201 = CMP-00862-3: RC0402 series chip resistor with lead-free terminations made by thick film process; Manufacturer: YAGEO; Manufacturer Part Number: RC0402FR-071K5L; Current Rating: 1A; Power Rating: 62,5mW; Temperature Coefficient: ±100ppm/K; Value: 1,5k; Voltage Rating: 50V; Assembly: yes; Case: 0402 [1005]; ComponentLink1Description: Datasheet; ComponentLink1URL: http://www.yageo.com/documents/recent/PYu-RC0402_51_RoHS_L_6.pdf; IPC Footprint Naming: RESC1005X04; Mounting Type: SMT; Operating Temperature max: 155°C; Operating Temperature min: -55°C; Resistance Tolerance: 1%; Resistor Element Type: Thick Film
R202 = CMP-02523-5: RC0805 series chip resistor with lead-free terminations made by thick film process; Manufacturer: YAGEO; Manufacturer Part Number: RC0805FR-076K49L; Assembly: yes; Current Rating: 2A; Temperature Coefficient: ±100ppm/K; Value: 6.49k; Voltage Rating: 150V; Case: 0805 [2012]; ComponentLink1Description: Manufacturer Link; ComponentLink1URL: http://www.yageo.com/NewPortal/yageo?service=chipResistors&layer2=Thick%20Film%20General%20Purpose&lang=en; IPC Footprint Naming: RESC2012X07; Mounting Type: SMT; Operating Temperature max: 155°C; Operating Temperature min: -55°C; Power Rating: 125mW; Resistance Tolerance: 1%; Resistor Element Type: Thick Film
R203 = CMP-04950-1: Thick film chip resistor 2512, 2W; Manufacturer: Bourns; Manufacturer Part Number: CRS2512-FW-3R30ELF; Assembly: yes; Temperature Coefficient: 200ppm/K; Value: 130; Voltage Rating: 600V; Case: 2512 [6432]; ComponentLink1Description: Datasheet; ComponentLink1URL: http://www.farnell.com/datasheets/2059763.pdf; IPC Footprint Naming: RESC6432X08; Mounting Type: SMD; Operating Temperature max: 155°C; Operating Temperature min: -55°C; Resistance Tolerance: 1%; Supplier: Farnell; Supplier Part ID: 2470979
R204 R210 R213 R214 = CMP-00958-3: RC0402 series chip resistor with lead-free terminations made by thick film process; Manufacturer: YAGEO; Manufacturer Part Number: RC0402FR-0710KL; Assembly: yes; Current Rating: 1A; Temperature Coefficient: ±100ppm/K; Voltage Rating: 50V; Case: 0402 [1005]; ComponentLink1Description: Datasheet; ComponentLink1URL: http://www.yageo.com/documents/recent/PYu-RC0402_51_RoHS_L_6.pdf; IPC Footprint Naming: RESC1005X04; Mounting Type: SMT; Operating Temperature max: 155°C; Operating Temperature min: -55°C; Power Rating: 62.5mW; Resistance Tolerance: 1%; Resistor Element Type: Thick Film; Value: 10k
R205 R206 R209 R227 R228 R231 R234-R237 R244-R246 R249 R250 = CMP-00958-3: RC0402 series chip resistor with lead-free terminations made by thick film process; Manufacturer: YAGEO; Manufacturer Part Number: RC0402FR-0710KL; Assembly: yes; Current Rating: 1A; Power Rating: 62,5mW; Temperature Coefficient: ±100ppm/K; Voltage Rating: 50V; Case: 0402 [1005]; ComponentLink1Description: Datasheet; ComponentLink1URL: http://www.yageo.com/documents/recent/PYu-RC0402_51_RoHS_L_6.pdf; IPC Footprint Naming: RESC1005X04; Mounting Type: SMT; Operating Temperature max: 155°C; Operating Temperature min: -55°C; Resistance Tolerance: 1%; Resistor Element Type: Thick Film; Value: 10k
R207 R208 = CMP-1015-00067-1: 510R 0.5W 5% 1210 (3225 Metric)  SMD; Case-EIA: 1210; Case-Metric: 3225; Technology: SMT; Tolerance: 5 %
R215-R217 R221-R224 R229 R238 R251 R252 = CMP-01074-3: RC0402 series chip resistor with lead-free terminations made by thick film process; Manufacturer: YAGEO; Manufacturer Part Number: RC0402FR-07100KL; Assembly: yes; Current Rating: 1A; Power Rating: 62,5mW; Temperature Coefficient: ±100ppm/K; Voltage Rating: 50V; Case: 0402 [1005]; ComponentLink1Description: Datasheet; ComponentLink1URL: http://www.yageo.com/documents/recent/PYu-RC0402_51_RoHS_L_6.pdf; IPC Footprint Naming: RESC1005X04; Mounting Type: SMT; Operating Temperature max: 155°C; Operating Temperature min: -55°C; Resistance Tolerance: 1%; Resistor Element Type: Thick Film; Value: 100k
R218 R219 R232 R233 = CMP-00729-3: RC0402 series chip resistor with lead-free terminations made by thick film process; Manufacturer: YAGEO; Manufacturer Part Number: RC0402FR-07100RL; Current Rating: 1A; Power Rating: 62,5mW; Temperature Coefficient: ±100ppm/K; Value: 100; Voltage Rating: 50V; Assembly: yes; Case: 0402 [1005]; ComponentLink1Description: Datasheet; ComponentLink1URL: http://www.yageo.com/documents/recent/PYu-RC0402_51_RoHS_L_6.pdf; IPC Footprint Naming: RESC1005X04; Mounting Type: SMT; Operating Temperature max: 155°C; Operating Temperature min: -55°C; Resistance Tolerance: 1%; Resistor Element Type: Thick Film
R225 = CMP-00770-3: RC0402 series chip resistor with lead-free terminations made by thick film process; Manufacturer: YAGEO; Manufacturer Part Number: RC0402FR-07240RL; Assembly: yes; Current Rating: 1A; Power Rating: 62,5mW; Temperature Coefficient: ±100ppm/K; Value: 240; Voltage Rating: 50V; Case: 0402 [1005]; ComponentLink1Description: Datasheet; ComponentLink1URL: http://www.yageo.com/documents/recent/PYu-RC0402_51_RoHS_L_6.pdf; IPC Footprint Naming: RESC1005X04; Mounting Type: SMT; Operating Temperature max: 155°C; Operating Temperature min: -55°C; Resistance Tolerance: 1%; Resistor Element Type: Thick Film
R226 = CMP-00836-3: RC0402 series chip resistor with lead-free terminations made by thick film process; Manufacturer: YAGEO; Manufacturer Part Number: RC0402FR-07866RL; Assembly: yes; Current Rating: 1A; Temperature Coefficient: ±100ppm/K; Value: 866; Voltage Rating: 50V; Case: 0402 [1005]; ComponentLink1Description: Datasheet; ComponentLink1URL: http://www.yageo.com/documents/recent/PYu-RC0402_51_RoHS_L_6.pdf; IPC Footprint Naming: RESC1005X04; Mounting Type: SMT; Operating Temperature max: 155°C; Operating Temperature min: -55°C; Power Rating: 62.5mW; Resistance Tolerance: 1%; Resistor Element Type: Thick Film
R230 = CMP-00793-3: RC0402 series chip resistor with lead-free terminations made by thick film process; Manufacturer: YAGEO; Manufacturer Part Number: RC0402FR-07374RL; Assembly: yes; Current Rating: 1A; Power Rating: 62,5mW; Temperature Coefficient: ±100ppm/K; Value: 374; Voltage Rating: 50V; Case: 0402 [1005]; ComponentLink1Description: Datasheet; ComponentLink1URL: http://www.yageo.com/documents/recent/PYu-RC0402_51_RoHS_L_6.pdf; IPC Footprint Naming: RESC1005X04; Mounting Type: SMT; Operating Temperature max: 155°C; Operating Temperature min: -55°C; Resistance Tolerance: 1%; Resistor Element Type: Thick Film
R242 = CMP-00616-3: RC0402 series chip resistor with lead-free terminations made by thick film process; Manufacturer: YAGEO; Manufacturer Part Number: RC0402FR-0710RL; Current Rating: 1A; Power Rating: 62,5mW; Temperature Coefficient: ±200ppm/K; Value: 10; Voltage Rating: 50V; Assembly: yes; ComponentLink1URL: http://www.yageo.com/documents/recent/PYu-RC0402_51_RoHS_L_6.pdf; IPC Footprint Naming: RESC1005X04; Mounting Type: SMT; Operating Temperature max: 155°C; Operating Temperature min: -55°C; Resistance Tolerance: 1%; Resistor Element Type: Thick Film; Case: 0402 [1005]; ComponentLink1Description: Datasheet
R243 = CMP-00891-3: RC0402 series chip resistor with lead-free terminations made by thick film process; Manufacturer: YAGEO; Manufacturer Part Number: RC0402FR-072K7L; Power Rating: 62,5mW; Temperature Coefficient: ±100ppm/K; Value: 2,7k; Voltage Rating: 50V; Assembly: yes; Current Rating: 1A; Case: 0402 [1005]; ComponentLink1Description: Datasheet; ComponentLink1URL: http://www.yageo.com/documents/recent/PYu-RC0402_51_RoHS_L_6.pdf; IPC Footprint Naming: RESC1005X04; Mounting Type: SMT; Operating Temperature max: 155°C; Operating Temperature min: -55°C; Resistance Tolerance: 1%; Resistor Element Type: Thick Film
R247 = CMP-01136-3: RC0402 series chip resistor with lead-free terminations made by thick film process; Manufacturer: YAGEO; Manufacturer Part Number: RC0402FR-07330KL; Assembly: yes; Current Rating: 1A; Temperature Coefficient: ±100ppm/K; Voltage Rating: 50V; Case: 0402 [1005]; ComponentLink1Description: Datasheet; ComponentLink1URL: http://www.yageo.com/documents/recent/PYu-RC0402_51_RoHS_L_6.pdf; IPC Footprint Naming: RESC1005X04; Mounting Type: SMT; Operating Temperature max: 155°C; Operating Temperature min: -55°C; Power Rating: 62.5mW; Resistance Tolerance: 1%; Resistor Element Type: Thick Film; Value: 330k
R248 = CMP-01051-3: RC0402 series chip resistor with lead-free terminations made by thick film process; Manufacturer: YAGEO; Manufacturer Part Number: RC0402FR-0762KL; Assembly: yes; Current Rating: 1A; Power Rating: 62,5mW; Temperature Coefficient: ±100ppm/K; Voltage Rating: 50V; Case: 0402 [1005]; ComponentLink1Description: Datasheet; ComponentLink1URL: http://www.yageo.com/documents/recent/PYu-RC0402_51_RoHS_L_6.pdf; IPC Footprint Naming: RESC1005X04; Mounting Type: SMT; Operating Temperature max: 155°C; Operating Temperature min: -55°C; Resistance Tolerance: 1%; Resistor Element Type: Thick Film; Value: 62k
S200 = CMP-00429-5: Tactile Switch SPST-NO Side Actuated Surface Mount, Right Angle; Assembly: yes; Contact Current Rating: 50mA; Contact Voltage DC: 12V; Number of Position: 1; Switch Function: off - on; Operating Temperature max: 70°C; Operating Temperature min: -20°C; Switch Type: Tactile; Case: EVQP7M; ComponentLink1Description: Datasheet; ComponentLink1URL: https://industrial.panasonic.com/cdbs/www-data/pdf/ATK0000/ATK0000CE20.pdf; Contact Form: SPST-NO; Manufacturer: PANASONIC; Mounting Type: SMT; Manufacturer Part Number: EVQ-P7M01P
TP200-TP205 TP207-TP218 = CMP-04511-8: Assembly: no; Case: 1.0x1.0mm, round
U200 = CMP-1305-00069-1: Single Supply Quad Comparators, 0 to 70 degC, 14-Pin TSSOP, Pb-Free, Tape and Reel; Manufacturer: On Semiconductor; IO Typ (mA): 16; PackageDescription: 14-Pin Small Outline Package, Body 5 x 4.4 mm, Pitch 0.65 mm; DatasheetVersion: Rev. 20; PackageVersion: Rev. B, 10/2006; ComponentLink2URL: http://www.onsemi.com/pub_link/Collateral/LM339-D.PDF; ComponentLink2Description: Datasheet; Mounting Technology: Surface Mount; RoHS: TRUE; ComponentLink1Description: Manufacturer URL; PackageReference: TSSOP-14-948G-01; PartNumber: LM339DTBR2G; ComponentLink3URL: http://www.onsemi.com/pub_link/Collateral/948G-01.PDF; ComponentLink1URL: http://www.onsemi.com/; Packing: Tape and Reel; ComponentLink3Description: Package Specification
U201 = CMP-06113-4: CAN-IC-Schnittstelle Single Wire CAN Transceiver (GMW3089 V2.x) in SOIC8; Assembly: yes; Supply Voltage max: 18V; Supply Voltage min: 6V; Case: SOIC-8; ComponentLink1Description: Datasheet; ComponentLink1URL: https://www.melexis.com/-/media/files/documents/product-flyers/th8056-product-flyer-melexis.pdf; IC Interface Type: CAN Transceiver; Manufacturer: MELEXIS; Manufacturer Part Number: TH8056KDC-AAA-008-RE; Mounting Type: SMT; Operating Temperature max: 125°C; Operating Temperature min: -40°C
U202 = CMP-0859-00046-3: Single 2-Input Positive-OR Gate, DBV0005A, LARGE T&R; Manufacturer: Texas Instruments; VCC(Min)(V): 1.65; Sub-Family: OR Gate; Schmitt Trigger: No; VCC(Max)(V): 5.5; Technology Family: LVC; F @ Nom Voltage(Max)(Mhz): 150; Input Type: CMOS/TTL; Output Drive (IOL/IOH)(Max)(mA): 32/-32; Rating: Catalog; Output Type: CMOS; Voltage(Nom)(V): 1.8,2.5,3.3,5; Bits(#): 1; tpd @ Nom Voltage(Max)(ns): 7.2,4.4,3.6,3.4; ICC @ Nom Voltage(Max)(mA): 0.01; Logic: True; Operating Temperature Range(C): -40 to 125,-40 to 85; DatasheetVersion: SCES219U; Generic Part Number: SN74LVC1G32; PackageReference: DBV0005A; 3-State Output: No
U203 = CMP-06092-5: The STN2120 and STN2100 are OBD to UART interpreter ICs designed to provide bi-directional, halfduplex communication with the vehicle¿s On-Board Diagnostic system (OBD-II).; Assembly: yes; Supply Voltage max: 3.6V; Supply Voltage min: 3V; Case: QFN-44; ComponentLink1Description: Datasheet; ComponentLink1URL: https://www.obdsol.com/solutions/chips/stn2120/; Manufacturer: OBD SOLUTIONS; Manufacturer Part Number: STN2120; Mounting Type: SMT; Operating Temperature max: 85°C; Operating Temperature min: -40°C
U204 U206 = CMP-06112-6: High-speed CAN Transceiver with Standby Mode and VIO Pin; Assembly: yes; Supply Voltage max: 5.5V; Supply Voltage min: 4.5V; Case: SON-8; ComponentLink1Description: Datasheet; ComponentLink1URL: http://www.farnell.com/datasheets/1885777.pdf; Manufacturer: MICROCHIP; Manufacturer Part Number: MCP2562-E/MF; Mounting Type: SMT; Operating Temperature max: 125°C; Operating Temperature min: -40°C
U205 = CMP-0244-00272-1: Low Current 1.2 to 37V Adjustable Voltage Regulator, 8-Pin SO, Tape and Reel; Code_JEDEC: MS-012-AA; PackageDescription: 8-Pin Small Outline Integrated Circuit 1.27 mm Pitch; Code_IPC: SOIC127P600-8; ComponentLink3Description: Package Specification; ComponentLink1Description: Manufacturer URL; DatasheetVersion: 1/05/2007; ComponentLink1URL: http://www.st.com; ComponentLink3URL: http://www.st.com/internet/com/TECHNICAL_RESOURCES/TECHNICAL_LITERATURE/PACKAGE_INFORMATION/CD00004680.pdf; ComponentLink2Description: Datasheet; PackageVersion: 1/12/2002; PackageReference: SO8; ComponentLink2URL: http://www.st.com/internet/com/TECHNICAL_RESOURCES/TECHNICAL_LITERATURE/DATASHEET/CD00000469.pdf
X200 = CMP-1688-00003-1: Ceramic SMD Crystal, 16 MHz, +/- 20 ppm, 50 Ohm, -20 to 70 degC, 4-Pin SMD, RoHS, Tape and Reel; Current Rating: 1.82 A; Resistance: 0.033 Ohm; Tolerance: 30%; Shielding: Shielded; REACH SVHC: Unknown; RoHSCompliant: True; PackageReference: ABM3B; Mount: Surface Mount; Max Operating Temperature: 105degC; DatasheetVersion: Aug-15; Package Quantity: 500; PackageDescription: 4-Pin Surface Mount Device, Body 5 x 3.2 mm; ComponentLink2URL: http://www.abracon.com/Resonators/abm3b.pdf; Packaging: Tape and Reel; Height: 2.8 mm; ComponentLink1URL: http://www.abracon.com/; ComponentLink2Description: Datasheet; Length: 0.197 inch; ComponentLink1Description: Manufacturer URL; Case/Package: 5028; Width: 0.197 inch; Min Operating Temperature: -40degC

## Nets that join several sheets
1.8V: RPI_CM3 (6 pins), PWR_Supply (C613.2 TP604.1 U602.5)
3.3V: RPI_CM3 (6 pins), PWR_Supply (7 pins), OBD_STN2120 (28 pins)
3.3V_SW: LTE_EM7455 (6 pins), RPI_CM3 (18 pins), USB_USB2534 (21 pins), OBD_STN2120 (Q214.3)
5V: RPI_CM3 (C301.2 U303.3), PWR_Supply (6 pins), OBD_STN2120 (6 pins)
5V_SW: RPI_CM3 (U300.197 U300.198 U300.199 U300.200), USB_USB2534 (9 pins), OBD_STN2120 (5 pins)
DLC: PWR_Supply (11 pins), OBD_STN2120 (9 pins)
DLC_RAW: OBD_Connector (P100.16 TP100.1), PWR_Supply (C600.2 F1.1)
GND: LTE_EM7455 (20 pins), OBD_Connector (7 pins), RPI_CM3 (91 pins), PWR_Supply (23 pins), USB_USB2534 (53 pins), OBD_STN2120 (62 pins)
~{PWR_SAVE}: PWR_Supply (Q600.G R605.2), OBD_STN2120 (6 pins)
J1850_BUS+: OBD_Connector (D102.2 P100.2 TP108.1), OBD_STN2120 (D200.3 R228.2 R236.2 R246.2)
J1850_BUS-: OBD_Connector (D102.1 P100.10 TP104.1), OBD_STN2120 (Q213.D R235.2 R237.1)
K-LINE: OBD_Connector (D101.2 P100.7 TP105.1), OBD_STN2120 (Q204.3 R206.2 R208.1)
NetC200_2: OBD_Connector (D100.1 P100.1 TP109.1), OBD_STN2120 (C200.2 R202.2 R203.2 U201.7)
NetD101_1: OBD_Connector (D101.1 P100.15 TP101.1), OBD_STN2120 (Q203.3 R207.1)
NetD103_1: OBD_Connector (D103.1 P100.14 TP102.1), OBD_STN2120 (R233.2 U206.6)
NetD103_2: OBD_Connector (D103.2 P100.6 TP106.1), OBD_STN2120 (R232.2 U206.7)
NetD104_1: OBD_Connector (D104.1 P100.11 TP103.1), OBD_STN2120 (R219.2 U204.6)
NetD104_2: OBD_Connector (D104.2 P100.3 TP107.1), OBD_STN2120 (R218.2 U204.7)
NetJ300_2: RPI_CM3 (J300.2 J300.6 J300.10 J300.14), OBD_STN2120 (U203.5)
NetJ300_4: RPI_CM3 (J300.4 J300.8 J300.12 J300.16), OBD_STN2120 (R220.1 U203.4)
NetJP301_1: RPI_CM3 (JP301.1 TP303.1), OBD_STN2120 (R251.1 TP208.1 U202.2 U203.32)
NetJP303_1: RPI_CM3 (JP303.1), OBD_STN2120 (R252.1 TP210.1 U203.27)
NetP400_6: LTE_EM7455 (P400.6 TP400.1), RPI_CM3 (R303.2 TP305.1 U300.33)
NetP400_8: LTE_EM7455 (P400.8 TP401.1), RPI_CM3 (R306.2 U300.15)
NetP400_26: LTE_EM7455 (P400.26 TP403.1), RPI_CM3 (R307.2 U300.17)
NetQ300_G: RPI_CM3 (Q300.G R302.2 TP302.1 U300.29), OBD_STN2120 (U202.1)
NetQ400_G: LTE_EM7455 (Q400.G), RPI_CM3 (R315.2 U300.83)
NetQ401_G: LTE_EM7455 (Q401.G), RPI_CM3 (R314.2 U300.81)
NetR300_1: RPI_CM3 (R300.1 TP300.1 U300.3), USB_USB2534 (TP501.1 U501.26)
NetR301_1: RPI_CM3 (R301.1 TP301.1 U300.9), OBD_STN2120 (TP215.1 U203.18)
USB_LTE_N: LTE_EM7455 (P400.9), USB_USB2534 (L503.3)
USB_LTE_P: LTE_EM7455 (P400.7), USB_USB2534 (L503.2)
USB_RPI_N: RPI_CM3 (U300.167), USB_USB2534 (JP1.1)
USB_RPI_P: RPI_CM3 (U300.165), USB_USB2534 (JP2.1)

## Assembly variants
Standard: not fitted C520 JP200 JP201 Q400 R315 R507 R512 R513 R514 U504